# EAGLE schematic attiny85_i2c_lcd_display (EAGLE 7.7.0)
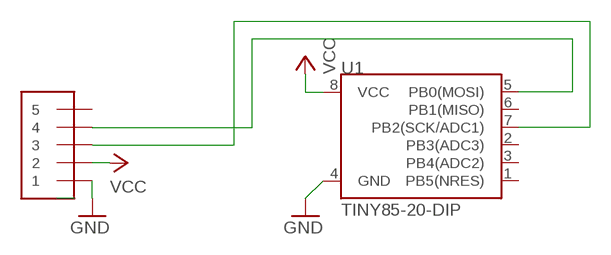
[diagram p0: schematic, sheet 1]

## Parts
J1  1X5  [3.5MM-5P]
U1  TINY85-20-DIP  ATTINY45TINY85-20-DIP  [DIP08_MCU]

## Nets
GND: J1.1 U1.4(GND)
N$1: J1.3 U1.7(PB2(SCK/ADC1))
N$2: J1.4 U1.5(PB0(MOSI))
VCC: J1.2 U1.8(VCC)
Unconnected: J1.5 U1.1(PB5(NRES)) U1.2(PB3(ADC3)) U1.3(PB4(ADC2)) U1.6(PB1(MISO))

## Library data of the parts
J1 = adafruit:1X5
U1 = SparkFun-Retired:ATTINY45: Atmel 8-pin 2/4/8kB flash uC Retired; PROD_ID: IC-09445